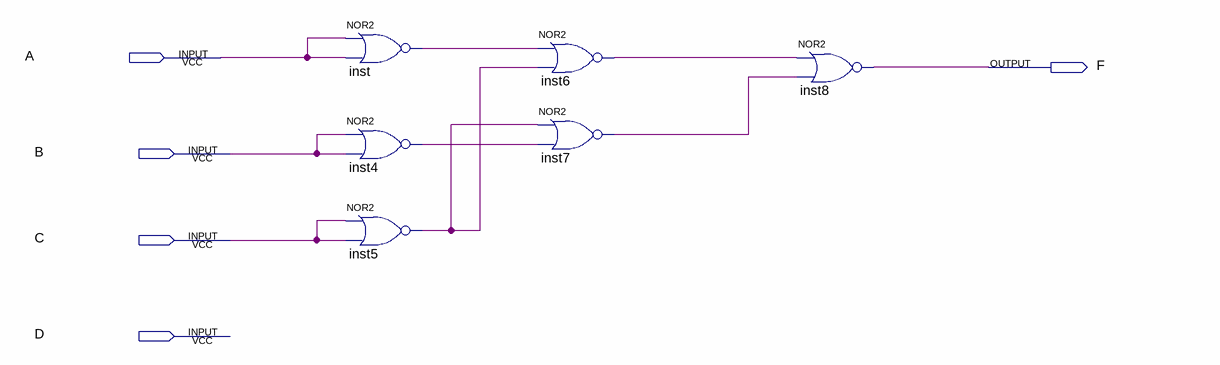
[diagram p0: schematic sheet]
// Quartus schematic nda1_3.bdf as structural Verilog: 6 symbols, 5 pins
module nda1_3 (
  input  A,
  input  B,
  input  C,
  input  D,
  output F
);

  wire inst4_out, inst5_out, inst6_out, inst7_out, inst_out;

  nor inst (inst_out, A, A);
  nor inst4 (inst4_out, B, B);
  nor inst5 (inst5_out, C, C);
  nor inst6 (inst6_out, inst_out, inst5_out);
  nor inst7 (inst7_out, inst5_out, inst4_out);
  nor inst8 (F, inst6_out, inst7_out);
endmodule
